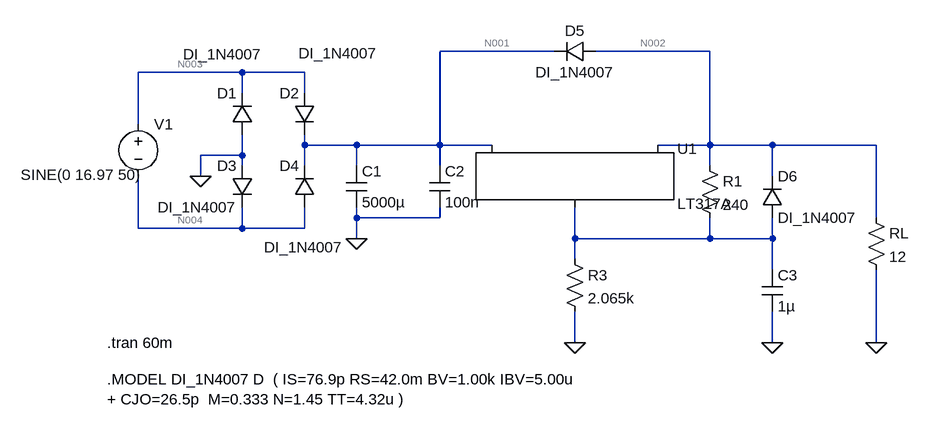
[diagram p0: schematic sim_FuenteV1.asc]
sim_FuenteV1.asc, the LTspice schematic file:
Version 4.1
SHEET 1 1336 680
WIRE 736 -16 560 -16
WIRE 976 -16 800 -16
WIRE 256 16 96 16
WIRE 352 16 256 16
WIRE 256 48 256 16
WIRE 352 48 352 16
WIRE 96 96 96 16
WIRE 352 128 352 112
WIRE 432 128 352 128
WIRE 560 128 560 -16
WIRE 560 128 432 128
WIRE 640 128 560 128
WIRE 976 128 976 -16
WIRE 976 128 896 128
WIRE 1072 128 976 128
WIRE 1232 128 1072 128
WIRE 256 144 256 112
WIRE 256 144 192 144
WIRE 256 160 256 144
WIRE 352 160 352 128
WIRE 432 160 432 128
WIRE 560 160 560 128
WIRE 976 160 976 128
WIRE 192 176 192 144
WIRE 1072 176 1072 128
WIRE 432 240 432 224
WIRE 560 240 560 224
WIRE 560 240 432 240
WIRE 1232 240 1232 128
WIRE 96 256 96 176
WIRE 256 256 256 224
WIRE 256 256 96 256
WIRE 352 256 352 224
WIRE 352 256 256 256
WIRE 432 272 432 240
WIRE 768 272 768 224
WIRE 976 272 976 240
WIRE 976 272 768 272
WIRE 1072 272 1072 240
WIRE 1072 272 976 272
WIRE 768 304 768 272
WIRE 1072 320 1072 272
WIRE 768 432 768 384
WIRE 1072 432 1072 384
WIRE 1232 432 1232 320
FLAG 192 176 0
FLAG 432 272 0
FLAG 768 432 0
FLAG 1232 432 0
FLAG 1072 432 0
SYMBOL voltage 96 80 R0
WINDOW 3 -181 94 Left 2
WINDOW 123 0 0 Left 0
WINDOW 39 0 0 Left 0
SYMATTR Value SINE(0 16.97 50)
SYMATTR InstName V1
SYMBOL res 1216 224 R0
SYMATTR InstName RL
SYMATTR Value 12
SYMBOL diode 272 112 R180
WINDOW 0 24 64 Left 2
WINDOW 3 -15 124 Left 2
SYMATTR InstName D1
SYMATTR Value DI_1N4007
SYMBOL diode 368 48 M0
WINDOW 3 -97 -61 Left 2
SYMATTR Value DI_1N4007
SYMATTR InstName D2
SYMBOL diode 272 160 M0
SYMATTR InstName D3
SYMATTR Value DI_1N4007
SYMBOL diode 368 224 R180
WINDOW 0 24 64 Left 2
WINDOW 3 -44 -61 Left 2
SYMATTR InstName D4
SYMATTR Value DI_1N4007
SYMBOL cap 416 160 R0
SYMATTR InstName C1
SYMATTR Value 5000µ
SYMBOL PowerProducts\\LT317A 768 128 R0
SYMATTR InstName U1
SYMBOL cap 544 160 R0
SYMATTR InstName C2
SYMATTR Value 100n
SYMBOL res 960 144 R0
SYMATTR InstName R1
SYMATTR Value 240
SYMBOL res 752 288 R0
SYMATTR InstName R3
SYMATTR Value 2.065k
SYMBOL diode 800 -32 R90
WINDOW 0 0 32 VBottom 2
WINDOW 3 32 32 VTop 2
SYMATTR InstName D5
SYMATTR Value DI_1N4007
SYMBOL diode 1056 240 M180
WINDOW 0 24 64 Left 2
WINDOW 3 24 0 Left 2
SYMATTR InstName D6
SYMATTR Value DI_1N4007
SYMBOL cap 1056 320 R0
SYMATTR InstName C3
SYMATTR Value 1µ
TEXT 48 432 Left 2 !.tran 60m
TEXT 48 488 Left 2 !.MODEL DI_1N4007 D  ( IS=76.9p RS=42.0m BV=1.00k IBV=5.00u\n+ CJO=26.5p  M=0.333 N=1.45 TT=4.32u )

The netlist it stands for:
* sim_FuenteV1.asc
V1 N003 N004 SINE(0 16.97 50)
RL N002 0 12
D1 0 N003 DI_1N4007
D2 N003 N001 DI_1N4007
D3 0 N004 DI_1N4007
D4 N004 N001 DI_1N4007
C1 N001 0 5000µ
X§U1 N005 N002 N001 LT317A
C2 N001 0 100n
R1 N002 N005 240
R3 N005 0 2.065k
D5 N002 N001 DI_1N4007
D6 N005 N002 DI_1N4007
C3 N005 0 1µ
.model D D
.lib standard.dio
.tran 60m
.MODEL DI_1N4007 D  ( IS=76.9p RS=42.0m BV=1.00k IBV=5.00u
+ CJO=26.5p  M=0.333 N=1.45 TT=4.32u )
.lib LTC.lib
.backanno
.end

* Results of the author's LTspice run, read from the files saved beside the schematic
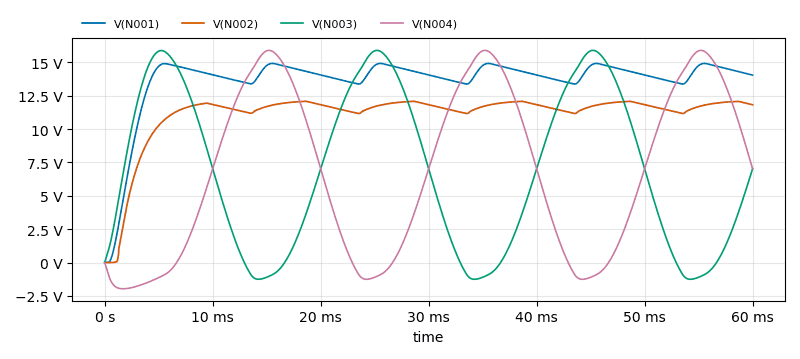
[diagram p1: Transient Analysis of sim_FuenteV1.asc, plotted from the saved traces]
* Transient Analysis, 1 run:
*   V(N001): min 10.04 mV, max 14.92 V, average 13.66 V, rms 13.86 V, last 14.05 V
*   V(N002): min 0 V, max 12.09 V, average 11.14 V, rms 11.35 V, last 11.82 V
*   V(N003): min -1.252 V, max 15.9 V, average 6.829 V, rms 9.076 V, last 7.024 V
*   V(N004): min -1.966 V, max 15.9 V, average 6.829 V, rms 9.258 V, last 7.024 V